# EAGLE design template_reva (EAGLE 7.2.0)
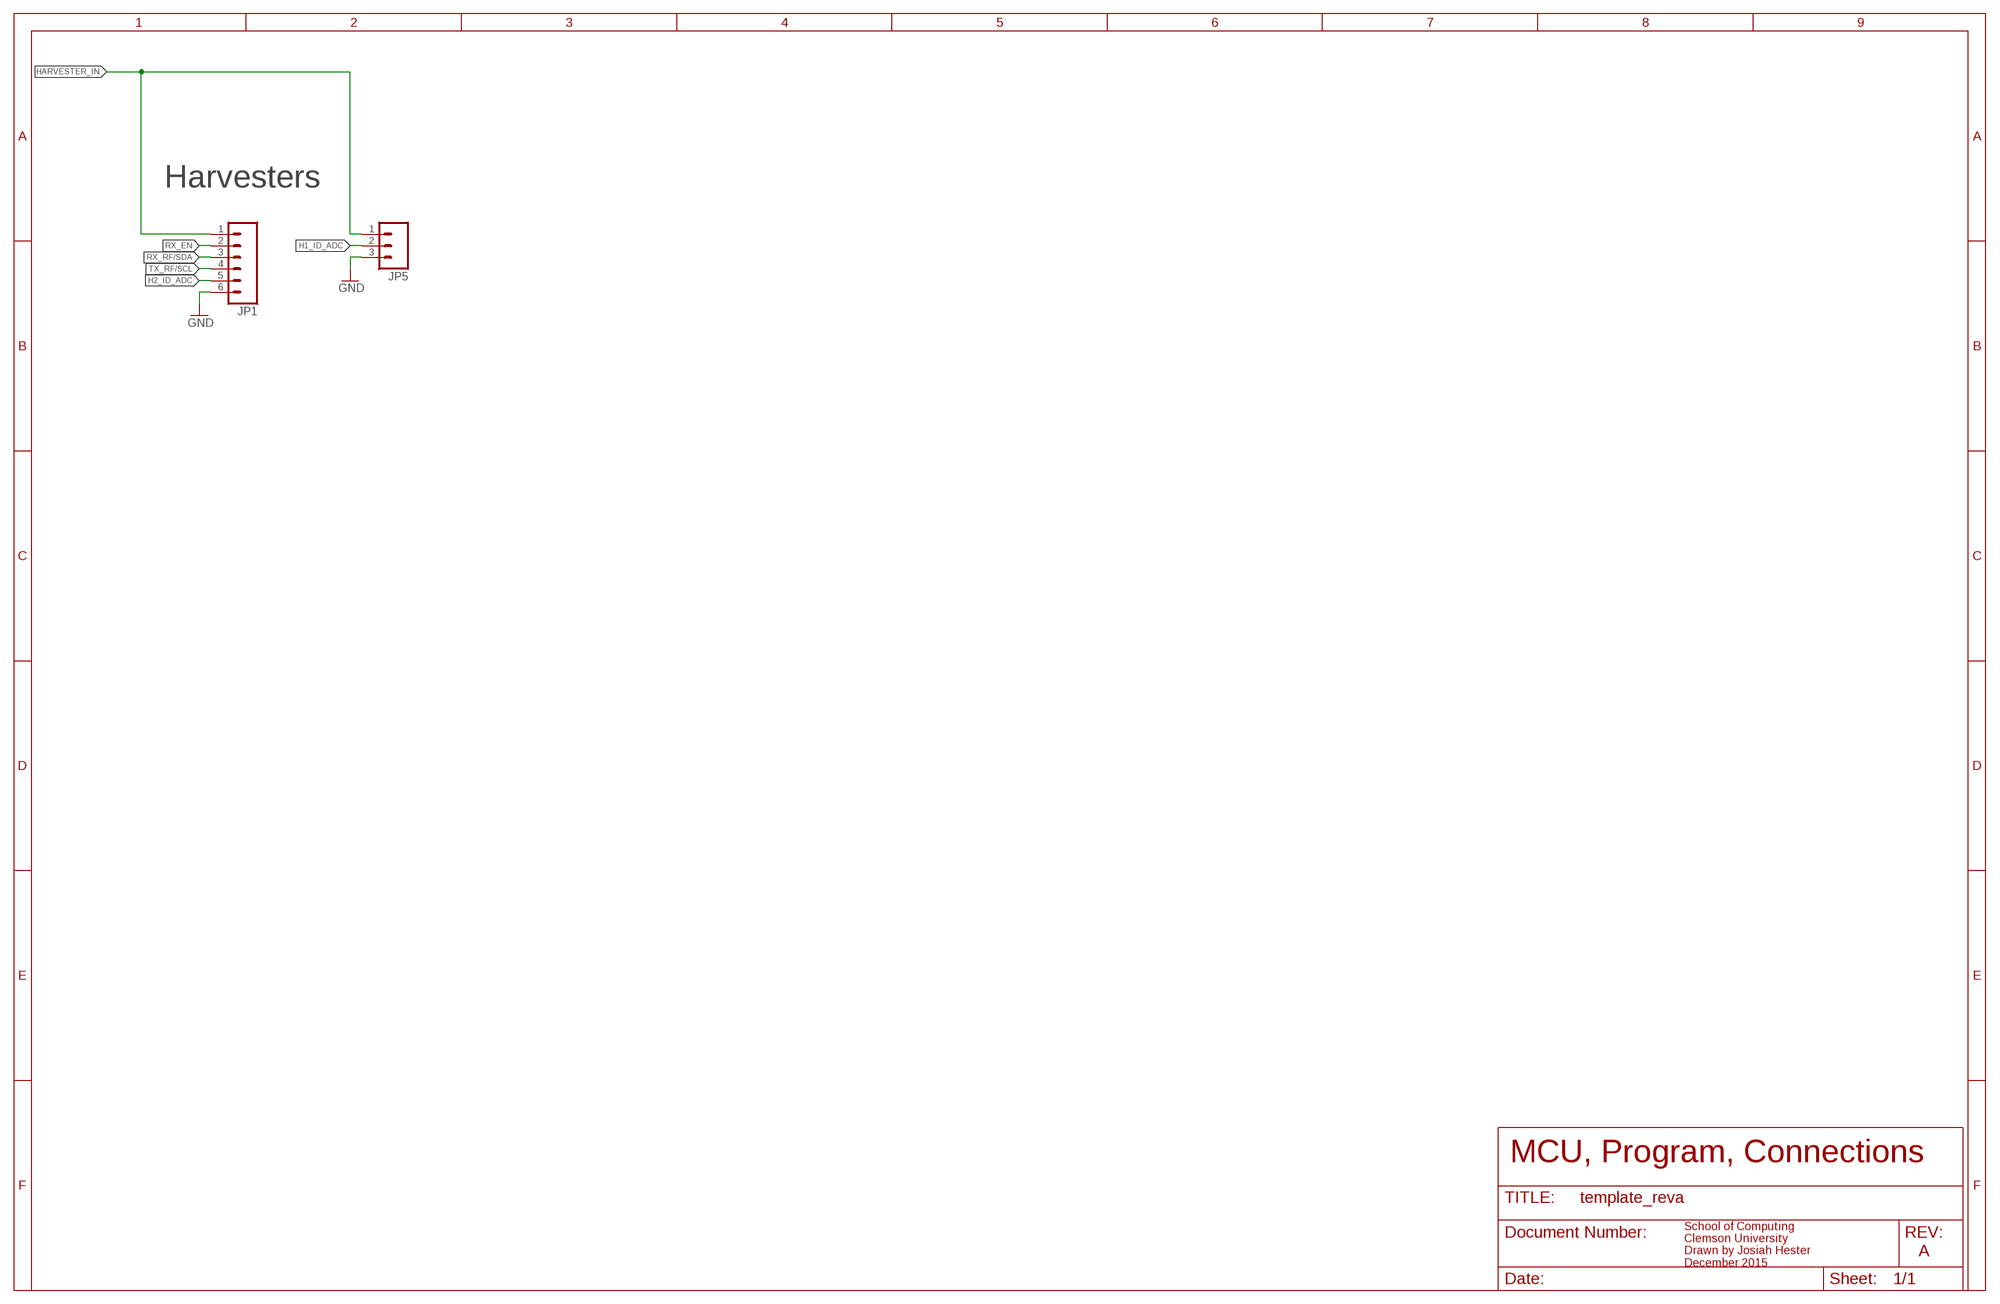
[diagram p0: schematic, sheet 1]

## Parts
JP1  M06  [1X06-1.27MM]
JP5  M03  [1X03-1.27MM]

## Nets
GND: JP1.6 JP5.3
H1_ID_ADC: JP5.2
H2_ID_ADC: JP1.5
HARVESTER_IN: JP1.1 JP5.1
RX_EN: JP1.2
RX_RF/SDA: JP1.3
TX_RF/SCL: JP1.4

## Notes on the sheet
- Harvesters
- MCU, Program, Connections
- A
- School of Computing
  Clemson University
  Drawn by Josiah Hester
  December 2015

## Library data of the parts
JP1 = SparkFun-Connectors:M06: Header 6 Standard 6-pin 0.1" header. Use with straight break away headers (SKU : PRT-00116), right angle break away headers (PRT-00553), swiss pins (PRT-00743), machine pins (PRT-00117), and female headers (PRT-00115). Molex polarized connector foot print use with SKU : PRT-08094 with associated crimp pins and housings. NOTES ON THE VARIANTS LOCK and LOCK_LONGPADS... This footprint was designed to help hold the alignment of a through-hole component (i.e. 6-pin header) while soldering it into place. You may notice that each hole has been shifted either up or down by 0.005 of an inch from it's more standard position (which is a perfectly straight line). This slight alteration caused the pins (the squares in the middle) to touch the edges of the holes. Because they are alternating, it causes a "brace" to hold the component in place. 0.005 has proven to be the perfect amount of "off-center" position when using our standard breakaway headers. Although looks a little odd when you look at the bare footprint, once you have a header in there, the alteration is very hard to notice. Also,if you push a header all the way into place, it is covered up entirely on the bottom side. This idea of altering the position of holes to aid alignment will be further integrated into the Sparkfun Library for other footprints. It can help hold any component with 3 or more connection pins.; DIGIKEY: S1011EC-40-ND
JP5 = SparkFun-Connectors:M03: Header 3 Standard 3-pin 0.1" header. Use with straight break away headers (SKU : PRT-00116), right angle break away headers (PRT-00553), swiss pins (PRT-00743), machine pins (PRT-00117), and female headers (PRT-00115). Molex polarized connector foot print use with SKU : PRT-08232 with associated crimp pins and housings.

## Board
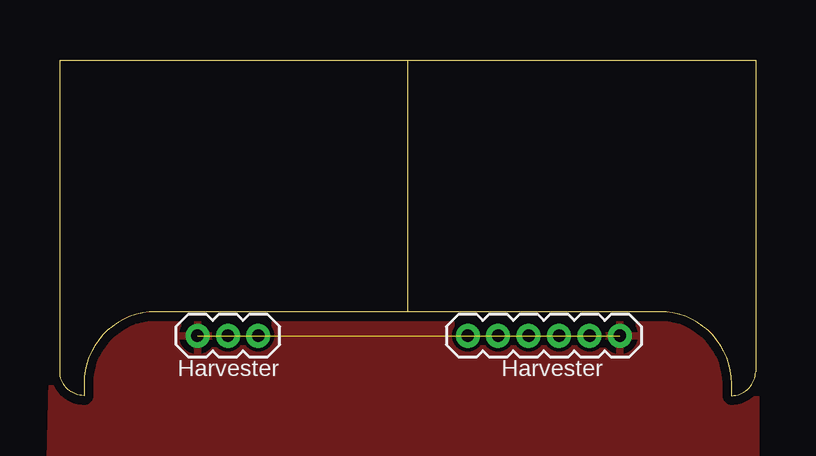
[diagram p1: board, top side]
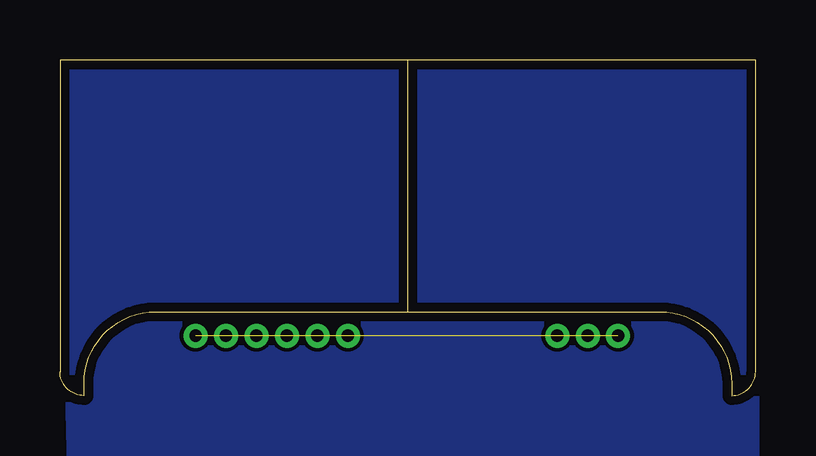
[diagram p2: board, bottom side, seen from below]

Size 29 x 14 mm. Coordinates in mm from the lower left corner, seen from the top.
Outline: 14.5,3.5 25,3.5 arc-90 28,0.5 28,0 arc90 29,1 29,14 14.5,14
Outline: 14.5,3.5 7,3.5 4,3.5 arc90 1,0.5 1,0 arc-90 0,1 0,14 14.5,14
Outline: 14.5,3.5 14.5,14
Copper layers (1*16): Top 0.0356mm / dielectric 1.5011mm / Bottom 0.0356mm
Design rules "LaenPCBOrder": minimum track width 6mil, minimum drill 13mil, track to track 6mil, track to pad 6mil, pad to pad 6mil, via to via 6mil, smd to smd 6mil, copper to edge 15mil, drill to drill 6mil, minimum pad ring 7mil, minimum via ring 7mil, stop-mask expansion 3mil, vias tented up to drill 0mil, thermal gap 10mil

### Footprints (pad centres in the part's own frame; a part is rotated, then mirrored left to right if it is on the bottom)
1X06-1.27MM = drill 0.508 pad 1: 1 0,0; 2 1.27,0; 3 2.54,0; 4 3.81,0; 5 5.08,0; 6 6.35,0
1X03-1.27MM = drill 0.508 pad 1: 1 -1.27,0; 2 0,0; 3 1.27,0

### Placement (x,y rotation side)
JP1  17,2.5 0 top
JP5  7,2.5 180 top

### Tracks (layer width: path | path; a pad name or v marks a point on that pad's centre or on a via)
GND  (1 unrouted)
  pour Top: -0.5,-6 29,-6 29,14 0,14
HARVESTER_IN  (1 unrouted)
VCC
  pour Bottom: 0,-6 28.5,-5.5 29,14 0,14

### Text on the board
tPlace: Harvester | Harvester